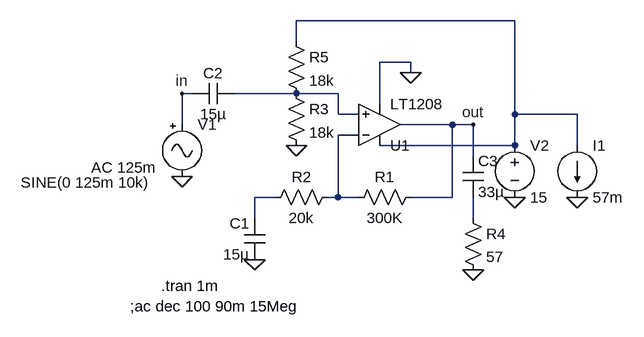
[diagram p0: schematic wzmacniacz.asc]
wzmacniacz.asc, the LTspice schematic file:
Version 4
SHEET 1 880 680
WIRE 400 -16 64 -16
WIRE 64 16 64 -16
WIRE 240 48 192 48
WIRE 240 64 240 48
WIRE -96 96 -112 96
WIRE 64 96 -32 96
WIRE 128 96 64 96
WIRE 192 112 192 48
WIRE 128 128 128 96
WIRE 160 128 128 128
WIRE 400 128 400 -16
WIRE 496 128 400 128
WIRE -112 144 -112 96
WIRE 304 144 224 144
WIRE 336 144 304 144
WIRE 160 160 128 160
WIRE 400 176 400 128
WIRE 400 176 192 176
WIRE 496 176 496 128
WIRE 336 192 336 144
WIRE 32 256 0 256
WIRE 128 256 128 160
WIRE 128 256 112 256
WIRE 160 256 128 256
WIRE 304 256 304 144
WIRE 304 256 240 256
WIRE 0 288 0 256
WIRE 336 288 336 256
FLAG 0 352 0
FLAG 64 176 0
FLAG 240 64 0
FLAG -112 224 0
FLAG 400 256 0
FLAG 336 368 0
FLAG -112 96 in
FLAG 336 144 out
FLAG 496 256 0
SYMBOL res 256 240 R90
WINDOW 0 0 56 VBottom 2
WINDOW 3 32 56 VTop 2
SYMATTR InstName R1
SYMATTR Value 300K
SYMBOL res 128 240 R90
WINDOW 0 0 56 VBottom 2
WINDOW 3 32 56 VTop 2
SYMATTR InstName R2
SYMATTR Value 20k
SYMBOL cap 16 352 R180
WINDOW 0 24 56 Left 2
WINDOW 3 24 8 Left 2
SYMATTR InstName C1
SYMATTR Value 15µ
SYMBOL res 48 80 R0
SYMATTR InstName R3
SYMATTR Value 18k
SYMBOL res 48 0 R0
SYMATTR InstName R5
SYMATTR Value 18k
SYMBOL cap -32 80 R90
WINDOW 0 0 32 VBottom 2
WINDOW 3 32 32 VTop 2
SYMATTR InstName C2
SYMATTR Value 15µ
SYMBOL Misc\\signal -112 128 R0
WINDOW 123 -140 82 Left 2
WINDOW 39 0 0 Left 0
WINDOW 3 -248 105 Left 2
SYMATTR Value2 AC 125m
SYMATTR Value SINE(0 125m 10k)
SYMATTR InstName V1
SYMBOL voltage 400 160 R0
WINDOW 123 0 0 Left 0
WINDOW 39 0 0 Left 0
SYMATTR InstName V2
SYMATTR Value 15
SYMBOL cap 320 192 R0
SYMATTR InstName C3
SYMATTR Value 33µ
SYMBOL res 320 272 R0
SYMATTR InstName R4
SYMATTR Value 57
SYMBOL OpAmps\\LT1208 192 208 M180
SYMATTR InstName U1
SYMBOL current 496 176 R0
WINDOW 123 0 0 Left 0
WINDOW 39 0 0 Left 0
SYMATTR InstName I1
SYMATTR Value 57m
TEXT -144 392 Left 2 !.tran 1m
TEXT -192 424 Left 2 !;ac dec 100 90m 15Meg

The netlist it stands for:
* wzmacniacz.asc
R1 out N003 300K
R2 N003 N004 20k
C1 0 N004 15µ
R3 N002 0 18k
R5 N001 N002 18k
C2 N002 in 15µ
V1 in 0 SINE(0 125m 10k) AC 125m
V2 N001 0 15
C3 out N005 33µ
R4 N005 0 57
XU1 N002 N003 N001 0 out LT1208  ; pins In+ In- V+ V- OUT
I1 N001 0 57m
.tran 1m
;ac dec 100 90m 15Meg
.backanno
.end